# EAGLE schematic Control PCb (EAGLE 9.6.2)
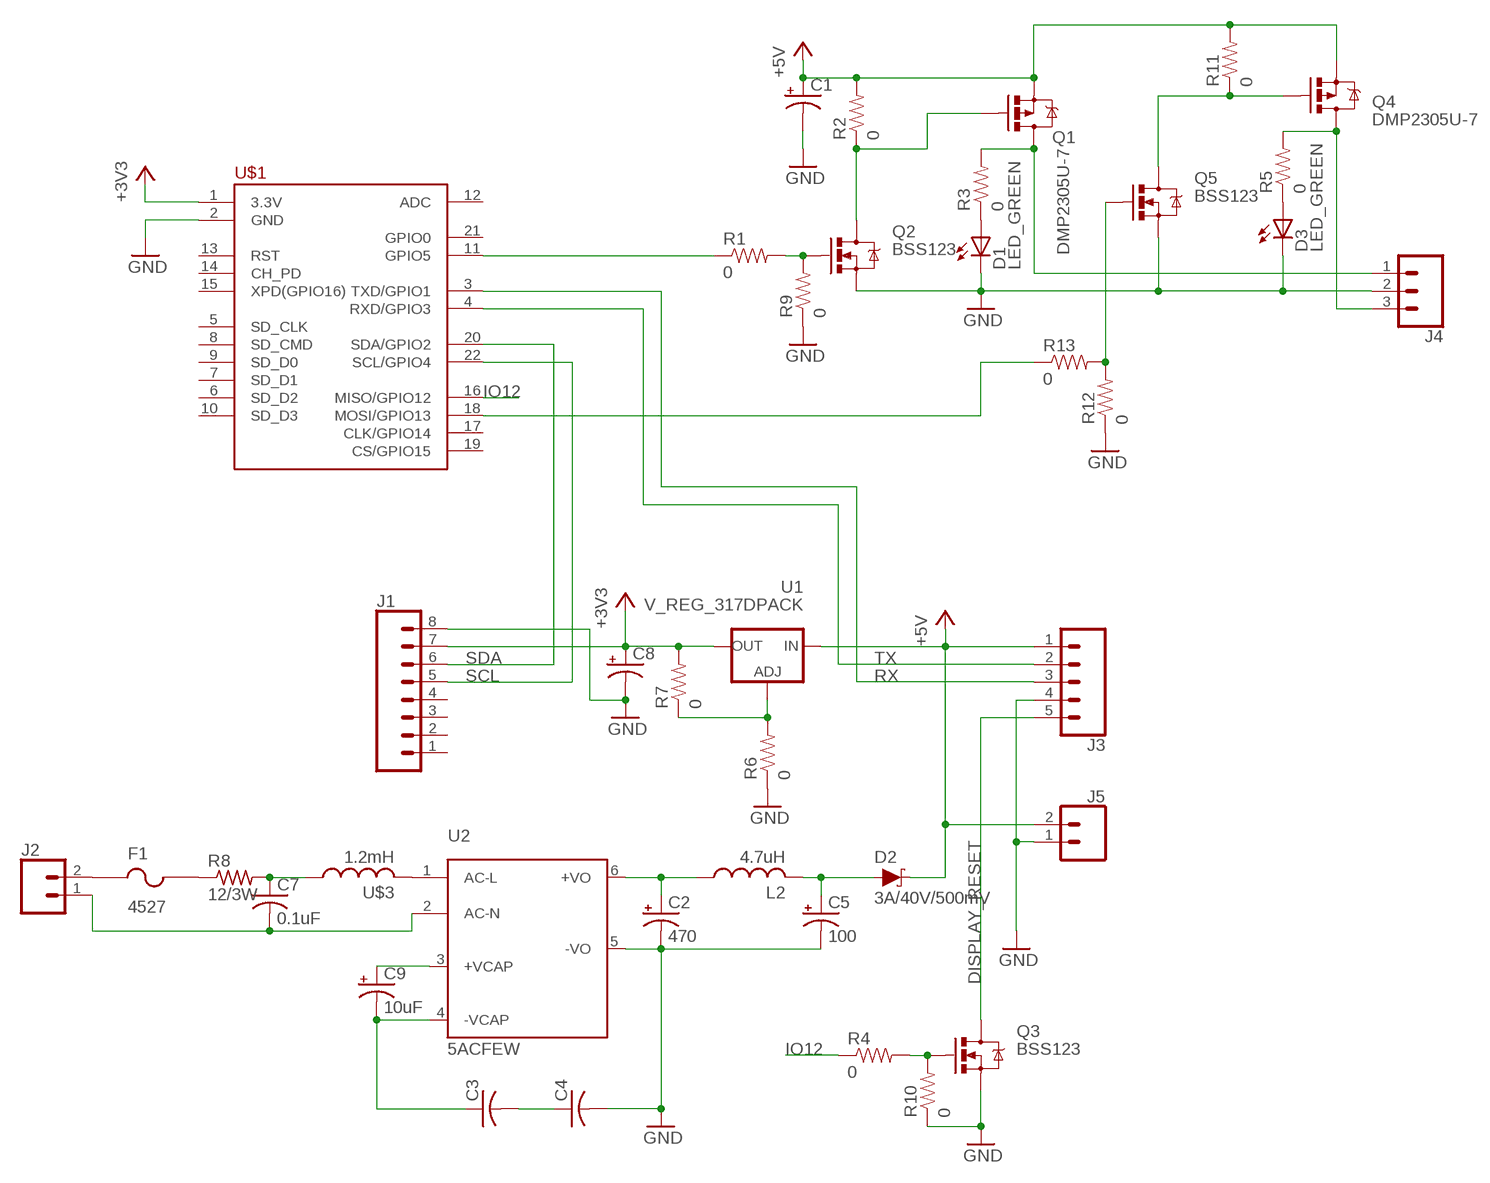
[diagram p0: schematic, sheet 1]

## Parts
C1  CPOL-USE2,5-6E  [E2,5-6E]
C2  470  1000UF-RADIAL-5MM-35V-20%-KIT  [CPOL-RADIAL-5MM-10MM-KIT]
C3  C-USC1210  [C1210]
C4  C-USC1210  [C1210]
C5  100  1000UF-RADIAL-5MM-35V-20%-KIT  [CPOL-RADIAL-5MM-10MM-KIT]
C7  0.1uF  C-US102-064X133  [C102-064X133]
C8  CPOL-USE2,5-6E  [E2,5-6E]
C9  10uF  1000UF-RADIAL-5MM-35V-20%-KIT  [CPOL-RADIAL-5MM-10MM-KIT]
D1  LED_GREEN  [CHIP_LED0805]
D2  3A/40V/500mV  DIODE-SCHOTTKY-B340A  [SMA-DIODE]
D3  LED_GREEN  [CHIP_LED0805]
F1  4527  [4527]
J1  CONN_08LOCK_LONGPADS  [1X08_LOCK_LONGPADS]
J2  CONN_025MM  [SCREWTERMINAL-5MM-2]
J3  CONN_05LOCK_LONGPADS  [1X05_LOCK_LONGPADS]
J4  CONN_03-SCREW-5MM  [SCREWTERMINAL-5MM-3]
J5  CONN_025MM  [SCREWTERMINAL-5MM-2]
L2  4.7uH  L  [6000]
Q1  DMP2305U-7  MOS-P_DMP2305U-7  [SOT23]
Q2  BSS123  MOS-N_BSS123  [SOT23]
Q3  BSS123  MOS-N_BSS123  [SOT23]
Q4  DMP2305U-7  MOS-P_DMP2305U-7  [SOT23]
Q5  BSS123  MOS-N_BSS123  [SOT23]
R1  0  RES_0_0805  [0805]
R2  0  RES_0_0805  [0805]
R3  0  RES_0_0805  [0805]
R4  0  RES_0_0805  [0805]
R5  0  RES_0_0805  [0805]
R6  0  RES_0_0805  [0805]
R7  0  RES_0_0805  [0805]
R8  12/3W  R-US_0817/7V  [P0817V]
R9  0  RES_0_0805  [0805]
R10  0  RES_0_0805  [0805]
R11  0  RES_0_0805  [0805]
R12  0  RES_0_0805  [0805]
R13  0  RES_0_0805  [0805]
U1  V_REG_317DPACK  [V-REG_DPACK]
U2  5ACFEW  [5ACFEW]
U$1  OLIMEX_MOD-WIFI-ESP8266-DEV>PINS-INSIDE  [OLIMEX_MOD-WIFI-ESP8266-DEV-PINS-INSIDE]
U$3  1.2mH  L1800R  [1800R]

## Nets
+3V3: C8.+ J1.7 R7.2 U1.4(OUT) U$1.1(3.3V)
+5V: C1.+ D2.C J3.1 J5.2 Q1.3(S) Q4.3(S) R2.2 R11.2 U1.3(IN)
DISPLAY_RESET: J3.5 Q3.3(D)
GND: C1.- C2.- C4.2 C5.- C8.- D1.C D3.C J1.8 J3.4 J4.2 J5.1 Q2.2(S) Q3.2(S) Q5.2(S) R6.1 R9.1 R10.1 R12.1 U2.5(-VO) U$1.2(GND)
IO12: R4.1 U$1.16(MISO/GPIO12)
N$1: D1.A R3.1
N$2: Q2.1(G) R1.2 R9.2
N$3: F1.1 J2.2
N$4: C7.2 J2.1 U2.2(AC-N)
N$5: Q1.1(G) Q2.3(D) R2.1
N$6: J4.1 Q1.2(D) R3.2
N$7: R1.1 U$1.11(GPIO5)
N$8: Q3.1(G) R4.2 R10.2
N$9: R6.2 R7.1 U1.1(ADJ)
N$10: F1.2 R8.1
N$11: C7.1 R8.2 U$3.1
N$12: U2.1(AC-L) U$3.2
N$13: C9.+ U2.3(+VCAP)
N$14: C3.1 C9.- U2.4(-VCAP)
N$15: C3.2 C4.1
N$16: J4.3 Q4.2(D) R5.2
N$17: C2.+ L2.1 U2.6(+VO)
N$18: C5.+ D2.A L2.2
N$19: D3.A R5.1
N$20: Q4.1(G) Q5.3(D) R11.1
N$21: R13.1 U$1.18(MOSI/GPIO13)
N$22: Q5.1(G) R12.2 R13.2
RX: J3.3 U$1.3(TXD/GPIO1)
SCL: J1.5 U$1.22(SCL/GPIO4)
SDA: J1.6 U$1.20(SDA/GPIO2)
TX: J3.2 U$1.4(RXD/GPIO3)
Unconnected: J1.1 J1.2 J1.3 J1.4 U$1.5(SD_CLK) U$1.6(SD_D2) U$1.7(SD_D1) U$1.8(SD_CMD) U$1.9(SD_D0) U$1.10(SD_D3) U$1.12(ADC) U$1.13(RST) U$1.14(CH_PD) U$1.15(XPD(GPIO16)) U$1.17(CLK/GPIO14) U$1.19(CS/GPIO15) U$1.21(GPIO0)

## Library data of the parts
C1 C8 = adafruit:CPOL-US: POLARIZED CAPACITOR, American symbol
C2 C5 C9 = SparkFun-Capacitors:1000UF: 1,000µF/1mF ceramic capacitors A capacitor is a passive two-terminal electrical component used to store electrical energy temporarily in an electric field. CAP-08070; PROD_ID: CAP-09538; VALUE: 1mf
C3 C4 C7 = adafruit:C-US: CAPACITOR, American symbol
D1 D3 = RJC-2:LED; PARTNO: LTST-S220GKT
D2 = SparkFun-DiscreteSemi:DIODE-SCHOTTKY: Schottky diode A Schottky diode is a semiconductor diode which has a low forward voltage drop and a very fast switching action.; PROD_ID: DIO-09886
F1 = RJC-2:4527
J1 = SparkFun-Connectors:CONN_08: Multi connection point. Often used as Generic Header-pin footprint for 0.1 inch spaced/style header connections On any of the 0.1 inch spaced packages, you can populate with these: Break Away Headers - Straight <https://www.sparkfun.com/products/116> (PRT-00116) Break Away Male Headers - Right Angle <https://www.sparkfun.com/products/553> (PRT-00553) Female Headers <https://www.sparkfun.com/products/115> (PRT-00115) Break Away Headers - Machine Pin <https://www.sparkfun.com/products/117> (PRT-00117) Break Away Female Headers - Swiss Machine Pin <https://www.sparkfun.com/products/743> (PRT-00743) Arduino Stackable Header - 8 Pin <https://www.sparkfun.com/products/9279> (PRT-09279) For SCREWTERMINALS and SPRING TERMINALS visit here: Screw Terimnals on SparkFun.com <https://www.sparkfun.com/search/results?term=Screw+Terminals> (5mm/3.5mm/2.54mm spacing) This device is also useful as a general connection point to wire up your design to another part of your project. Our various solder wires solder well into these plated through hole pads. Hook-Up Wire - Assortment (Stranded, 22 AWG) <https://www.sparkfun.com/products/11375> (PRT-11375) Hook-Up Wire - Assortment (Solid Core, 22 AWG) <https://www.sparkfun.com/products/11367> (PRT-11367) View the entire wire category on our website here <https://www.sparkfun.com/categories/141> Special notes: Molex polarized connector foot print use with SKU : PRT-08231 with associated crimp pins and housings. 1MM SMD Version SKU: PRT-10208 NOTES ON THE VARIANTS LOCK and LOCK_LONGPADS... This footprint was designed to help hold the alignment of a through-hole component (i.e. 6-pin header) while soldering it into place. You may notice that each hole has been shifted either up or down by 0.005 of an inch from it's more standard position (which is a perfectly straight line). This slight alteration caused the pins (the squares in the middle) to touch the edges of the holes. Because they are alternating, it causes a "brace" to hold the component in place. 0.005 has proven to be the perfect amount of "off-center" position when using our standard breakaway headers. Although looks a little odd when you look at the bare footprint, once you have a header in there, the alteration is very hard to notice. Also,if you push a header all the way into place, it is covered up entirely on the bottom side.
J2 J5 = SparkFun-Connectors:CONN_02: Multi connection point. Often used as Generic Header-pin footprint for 0.1 inch spaced/style header connections On any of the 0.1 inch spaced packages, you can populate with these: Break Away Headers - Straight <https://www.sparkfun.com/products/116> (PRT-00116) Break Away Male Headers - Right Angle <https://www.sparkfun.com/products/553> (PRT-00553) Female Headers <https://www.sparkfun.com/products/115> (PRT-00115) Break Away Headers - Machine Pin <https://www.sparkfun.com/products/117> (PRT-00117) Break Away Female Headers - Swiss Machine Pin <https://www.sparkfun.com/products/743> (PRT-00743) For SCREWTERMINALS and SPRING TERMINALS visit here: Screw Terimnals on SparkFun.com <https://www.sparkfun.com/search/results?term=Screw+Terminals> (5mm/3.5mm/2.54mm spacing) This device is also useful as a general connection point to wire up your design to another part of your project. Our various solder wires solder well into these plated through hole pads. Hook-Up Wire - Assortment (Stranded, 22 AWG) <https://www.sparkfun.com/products/11375> (PRT-11375) Hook-Up Wire - Assortment (Solid Core, 22 AWG) <https://www.sparkfun.com/products/11367> (PRT-11367) View the entire wire category on our website here <https://www.sparkfun.com/categories/141> Special notes: Molex polarized connector foot print use with: PRT-08233 with associated crimp pins and housings. 2.54_SCREWTERM for use with PRT-10571. 3.5mm Screw Terminal footprints for PRT-08084 5mm Screw Terminal footprints for use with PRT-08432; SF_SKU: PRT-08432
J3 = SparkFun-Connectors:CONN_05: Multi connection point. Often used as Generic Header-pin footprint for 0.1 inch spaced/style header connections On any of the 0.1 inch spaced packages, you can populate with these: Break Away Headers - Straight <https://www.sparkfun.com/products/116> (PRT-00116) Break Away Male Headers - Right Angle <https://www.sparkfun.com/products/553> (PRT-00553) Female Headers <https://www.sparkfun.com/products/115> (PRT-00115) Break Away Headers - Machine Pin <https://www.sparkfun.com/products/117> (PRT-00117) Break Away Female Headers - Swiss Machine Pin <https://www.sparkfun.com/products/743> (PRT-00743) For SCREWTERMINALS and SPRING TERMINALS visit here: Screw Terimnals on SparkFun.com <https://www.sparkfun.com/search/results?term=Screw+Terminals> (5mm/3.5mm/2.54mm spacing) This device is also useful as a general connection point to wire up your design to another part of your project. Our various solder wires solder well into these plated through hole pads. Hook-Up Wire - Assortment (Stranded, 22 AWG) <https://www.sparkfun.com/products/11375> (PRT-11375) Hook-Up Wire - Assortment (Solid Core, 22 AWG) <https://www.sparkfun.com/products/11367> (PRT-11367) View the entire wire category on our website here <https://www.sparkfun.com/categories/141> Special notes: Molex polarized connector foot print use with SKU : PRT-08231 with associated crimp pins and housings. 1MM SMD Version SKU: PRT-10208
J4 = SparkFun-Connectors:CONN_03: Multi connection point. Often used as Generic Header-pin footprint for 0.1 inch spaced/style header connections On any of the 0.1 inch spaced packages, you can populate with these: Break Away Headers - Straight <https://www.sparkfun.com/products/116> (PRT-00116) Break Away Male Headers - Right Angle <https://www.sparkfun.com/products/553> (PRT-00553) Female Headers <https://www.sparkfun.com/products/115> (PRT-00115) Break Away Headers - Machine Pin <https://www.sparkfun.com/products/117> (PRT-00117) Break Away Female Headers - Swiss Machine Pin <https://www.sparkfun.com/products/743> (PRT-00743) Stackable Header - 3 Pin (Female, 0.1") <https://www.sparkfun.com/products/13875> (PRT-13875) For SCREWTERMINALS and SPRING TERMINALS visit here: Screw Terimnals on SparkFun.com <https://www.sparkfun.com/search/results?term=Screw+Terminals> (5mm/3.5mm/2.54mm spacing) This device is also useful as a general connection point to wire up your design to another part of your project. Our various solder wires solder well into these plated through hole pads. Hook-Up Wire - Assortment (Stranded, 22 AWG) <https://www.sparkfun.com/products/11375> (PRT-11375) Hook-Up Wire - Assortment (Solid Core, 22 AWG) <https://www.sparkfun.com/products/11367> (PRT-11367) View the entire wire category on our website here <https://www.sparkfun.com/categories/141> Special notes: Molex polarized connector foot print use with SKU : PRT-08232 with associated crimp pins and housings.; PROD_ID: CONN-10134; SF_SKU: PRT-08433
L2 U$3 = adafruit:L
Q1 Q4 = RJC-2:MOS-P: P-Channel Mosfets; PARTNO: DMP2305U-7
Q2 Q3 Q5 = RJC-2:MOS-N: N-Channel Mosfets; PARTNO: BSS123,215
R1-R7 R9-R13 = RJC-2:RES: Resistors; PARTNO: RC0805JR-070RL
R8 = adafruit:R-US_: RESISTOR, American symbol
U1 = SparkFun-IC-Power:V_REG_317: Voltage Regulator Standard LM317 adjustable voltage regulator. AOI (Adjust Output Input). Google 'LM317 Calculator' for easy to use app to get the two resistor values needed. 240/720 for 5V output. 240/390 for 3.3V output. Spark Fun Electronics SKU : COM-00527; PROD_ID: IC-09888
U2 = RJC-2:5ACFEW
U$1 = esp8266modules:OLIMEX_MOD-WIFI-ESP8266-DEV: Olimex MOD-WIFI-ESP8266-DEV is an development board for ESP8266 with all GPIOs and resources exposed. It can be soldered to PCB or used with breadboard. Small U.FL connector is provided for external antenna connection.